# EAGLE design BatDuino1.0 (EAGLE 9.2.0)
CNAME: µgurkrcl; CREVISION: A; DESIGNER: Uğur KIRÇIL

## Sheet 1 of 2: Basic Arduino Func
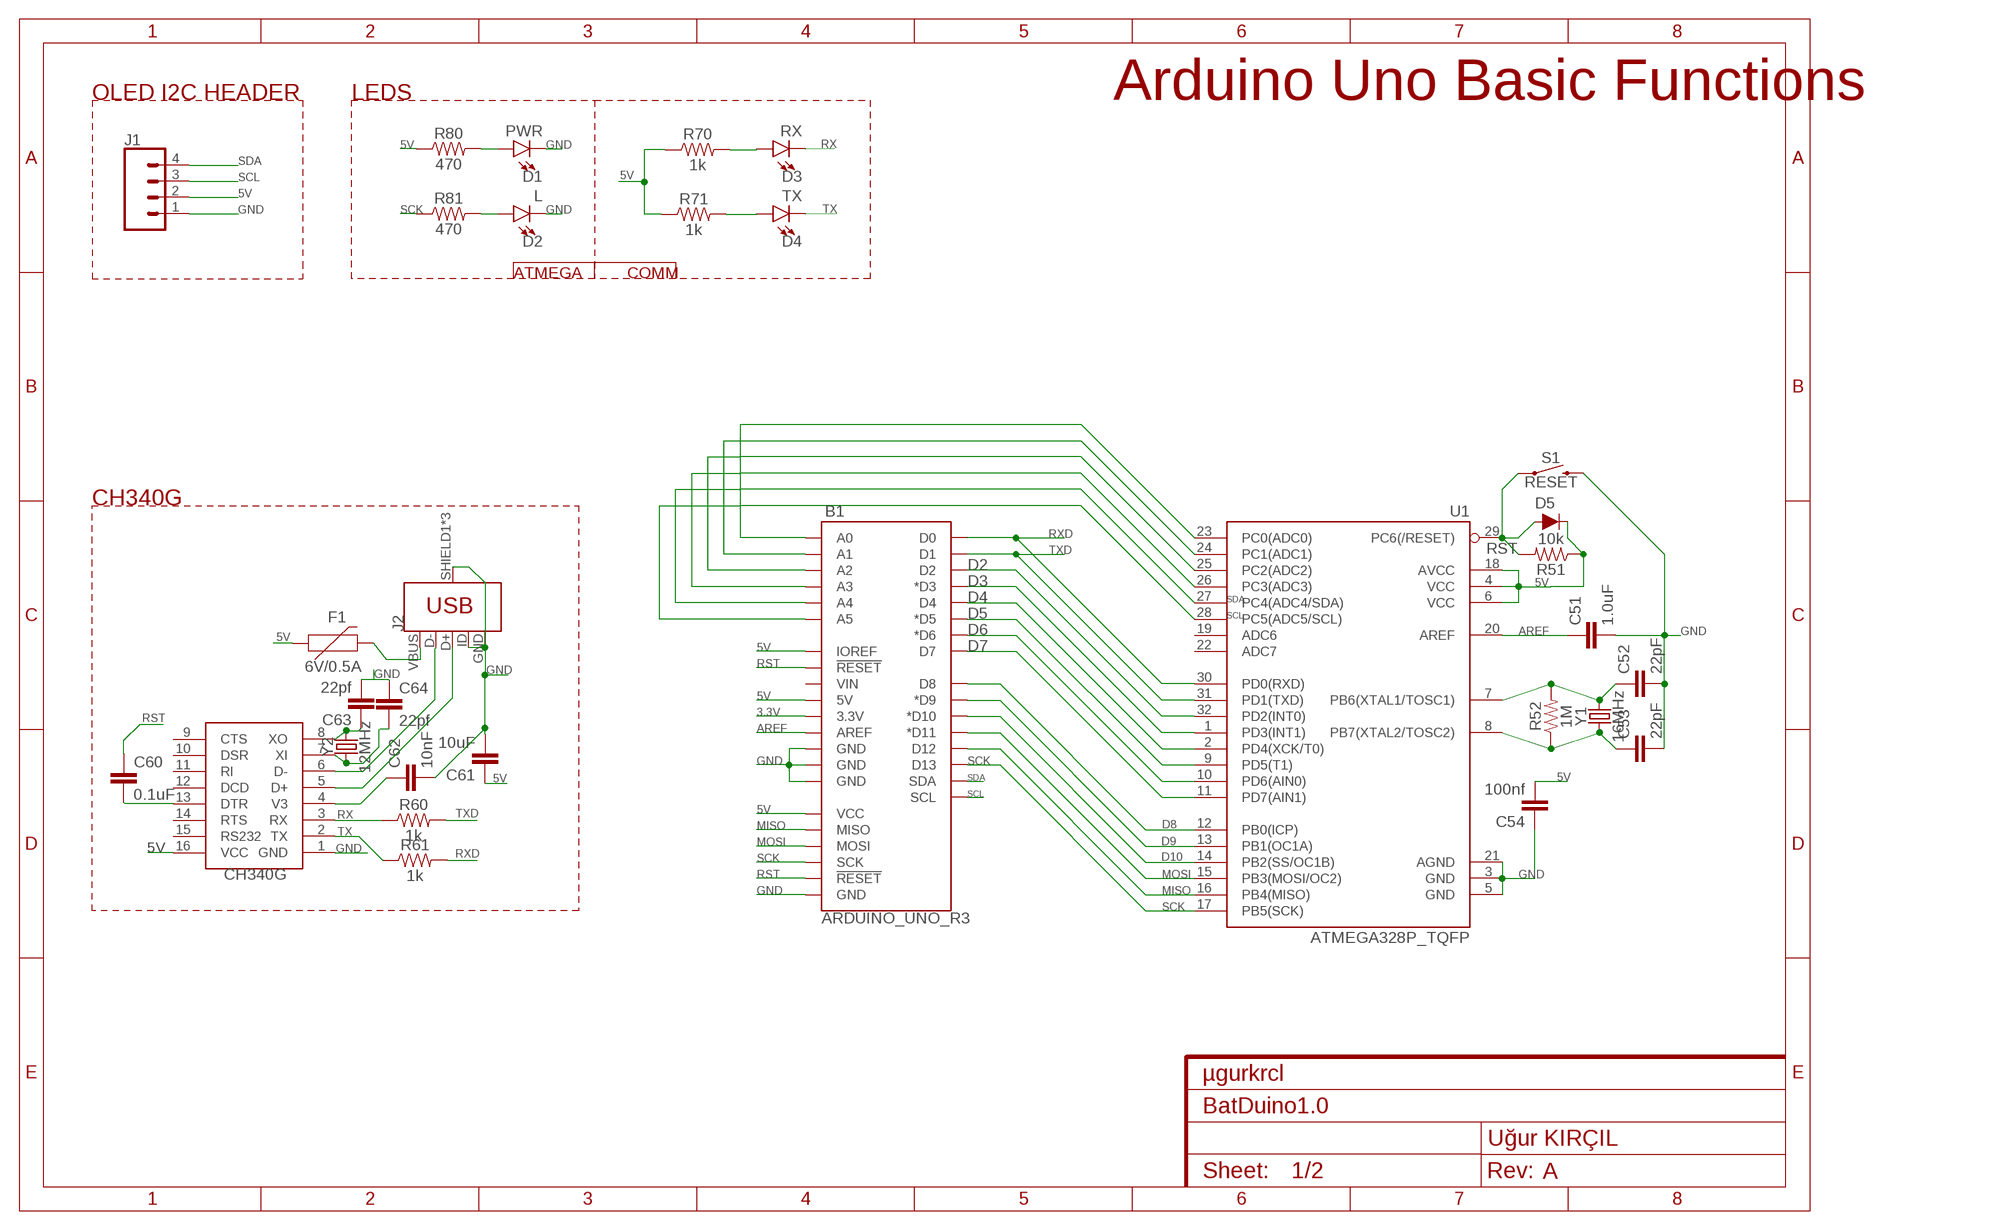
[diagram p0: schematic, sheet 1]

### Parts
B1  ARDUINO_UNO_R3  [ARDUINO_R3]
C51  1.0uF  1.0UF-0603-16V-10%  [0603]
C52  22pF  22PF-0603-50V-5%  [0603]
C53  22pF  22PF-0603-50V-5%  [0603]
C54  100nf  22PF-0603-50V-5%  [0603]
C60  0.1uF  0.1UF-0603-25V-5%  [0603]
C61  10uF  0.18UF-0603-10V-10%  [0603]
C62  10nF  0.18UF-0603-10V-10%  [0603]
C63  22pf  0.18UF-0603-10V-10%  [0603]
C64  22pf  0.18UF-0603-10V-10%  [0603]
D1  PWR  LED-GREEN0603  [LED-0603]
D2  L  LED-GREEN0603  [LED-0603]
D3  RX  LED-GREEN0603  [LED-0603]
D4  TX  LED-GREEN0603  [LED-0603]
D5  DIODE-BAS16J  [SOD-323]
F1  6V/0.5A  PPTC_HALF-AMP  [1206]
J1  CONN_04  [1X04]
J2  USB_MICRO-BREDUCED_PASTE  [USB-B-MICRO-SMD_RED_PASTE]
R51  10k  10KOHM-0603-1/10W-1%  [0603]
R52  1M  1MOHM-0603-1/4W-5%  [0603]
R60  1k  1KOHM-0603-1/10W-1%  [0603]
R61  1k  1KOHM-0603-1/10W-1%  [0603]
R70  1k  1KOHM-0603-1/10W-1%  [0603]
R71  1k  1KOHM-0603-1/10W-1%  [0603]
R80  470  470OHM-0603-1/10W-1%  [0603]
R81  470  470OHM-0603-1/10W-1%  [0603]
S1  RESET  MOMENTARY-SWITCH-SPST-PTH-6.0MM  [TACTILE_SWITCH_PTH_6.0MM]
U1  ATMEGA328P_TQFP  [TQFP32-08]
U$1  CH340G  [SOIC16]
Y1  16MHz  CRYSTAL-16MHZPTH-HC49US  [HC49US]
Y2  12MHz  CRYSTAL-16MHZPTH-HC49US  [HC49US]

### Nets
3.3V: B1.3.3V ; also sheet 2
5V: B1.5V B1.IOREF B1.VCC C54.2 C61.1 D5.C F1.1 J1.2 R51.1 R70.1 R71.1 R80.1 U1.4(VCC) U1.6(VCC) U1.18(AVCC) U$1.16(VCC) ; also sheet 2
AREF: B1.AREF C51.1 U1.20(AREF)
D2: B1.D2 U1.32(PD2(INT0)) ; also sheet 2
D3: B1.D3(*D3) U1.1(PD3(INT1)) ; also sheet 2
D4: B1.D4 U1.2(PD4(XCK/T0)) ; also sheet 2
D5: B1.D5(*D5) U1.9(PD5(T1)) ; also sheet 2
D6: B1.D6(*D6) U1.10(PD6(AIN0)) ; also sheet 2
D7: B1.D7 U1.11(PD7(AIN1))
D8: B1.D8 U1.12(PB0(ICP))
D9: B1.D9(*D9) U1.13(PB1(OC1A))
D10: B1.D10(*D10) U1.14(PB2(SS/OC1B))
GND: B1.GND@1(GND) B1.GND@2(GND) B1.GND@3(GND) B1.GND@4(GND) C51.2 C52.2 C53.2 C54.1 C61.2 C62.2 D1.C D2.C J1.1 J2.GND J2.ID J2.SHIELD1(SHIELD) J2.SHIELD2(SHIELD) J2.SHIELD3(SHIELD) S1.3 U1.3(GND) U1.5(GND) U1.21(AGND) U$1.1(GND) ; also sheet 2
MISO: B1.D12 B1.MISO U1.16(PB4(MISO))
MOSI: B1.D11(*D11) B1.MOSI U1.15(PB3(MOSI/OC2))
N$1: C52.1 R52.2 U1.7(PB6(XTAL1/TOSC1)) Y1.2
N$2: C53.1 R52.1 U1.8(PB7(XTAL2/TOSC2)) Y1.1
N$12: D1.A R80.2
N$13: C62.1 U$1.4(V3)
N$14: F1.2 J2.VBUS
N$15: D3.A R70.2
N$16: D4.A R71.2
N$17: D2.A R81.2
N$18: J2.D+ U$1.5(D+)
N$19: J2.D- U$1.6(D-)
N$20: B1.A0 U1.23(PC0(ADC0))
N$21: B1.A1 U1.24(PC1(ADC1))
N$22: B1.A2 U1.25(PC2(ADC2))
N$23: B1.A3 U1.26(PC3(ADC3))
N$24: C63.1 U$1.8(XO) Y2.2
N$25: C64.2 U$1.7(XI) Y2.1
N$26: C63.2 C64.1
N$27: C60.2 U$1.13(DTR)
RST: B1.RESET@1(!RESET!) B1.RESET@2(!RESET!) C60.1 D5.A R51.2 S1.1 U1.29(PC6(/RESET))
RX: D3.C R60.1 U$1.3(RX)
RXD: B1.D0 R61.2 U1.30(PD0(RXD))
SCK: B1.D13 B1.SCK R81.1 U1.17(PB5(SCK))
SCL: B1.A5 B1.SCL J1.3 U1.28(PC5(ADC5/SCL)) ; also sheet 2
SDA: B1.A4 B1.SDA J1.4 U1.27(PC4(ADC4/SDA)) ; also sheet 2
TX: D4.C R61.1 U$1.2(TX)
TXD: B1.D1 R60.2 U1.31(PD1(TXD))
Unconnected: B1.VIN U1.19(ADC6) U1.22(ADC7) U$1.9(CTS) U$1.10(DSR) U$1.11(RI) U$1.12(DCD) U$1.14(RTS) U$1.15(RS232)

### Notes on the sheet
- OLED I2C HEADER | LEDS | Arduino Uno Basic Functions
- ATMEGA | COMM
- CH340G

## Sheet 2 of 2: FG CHARGER
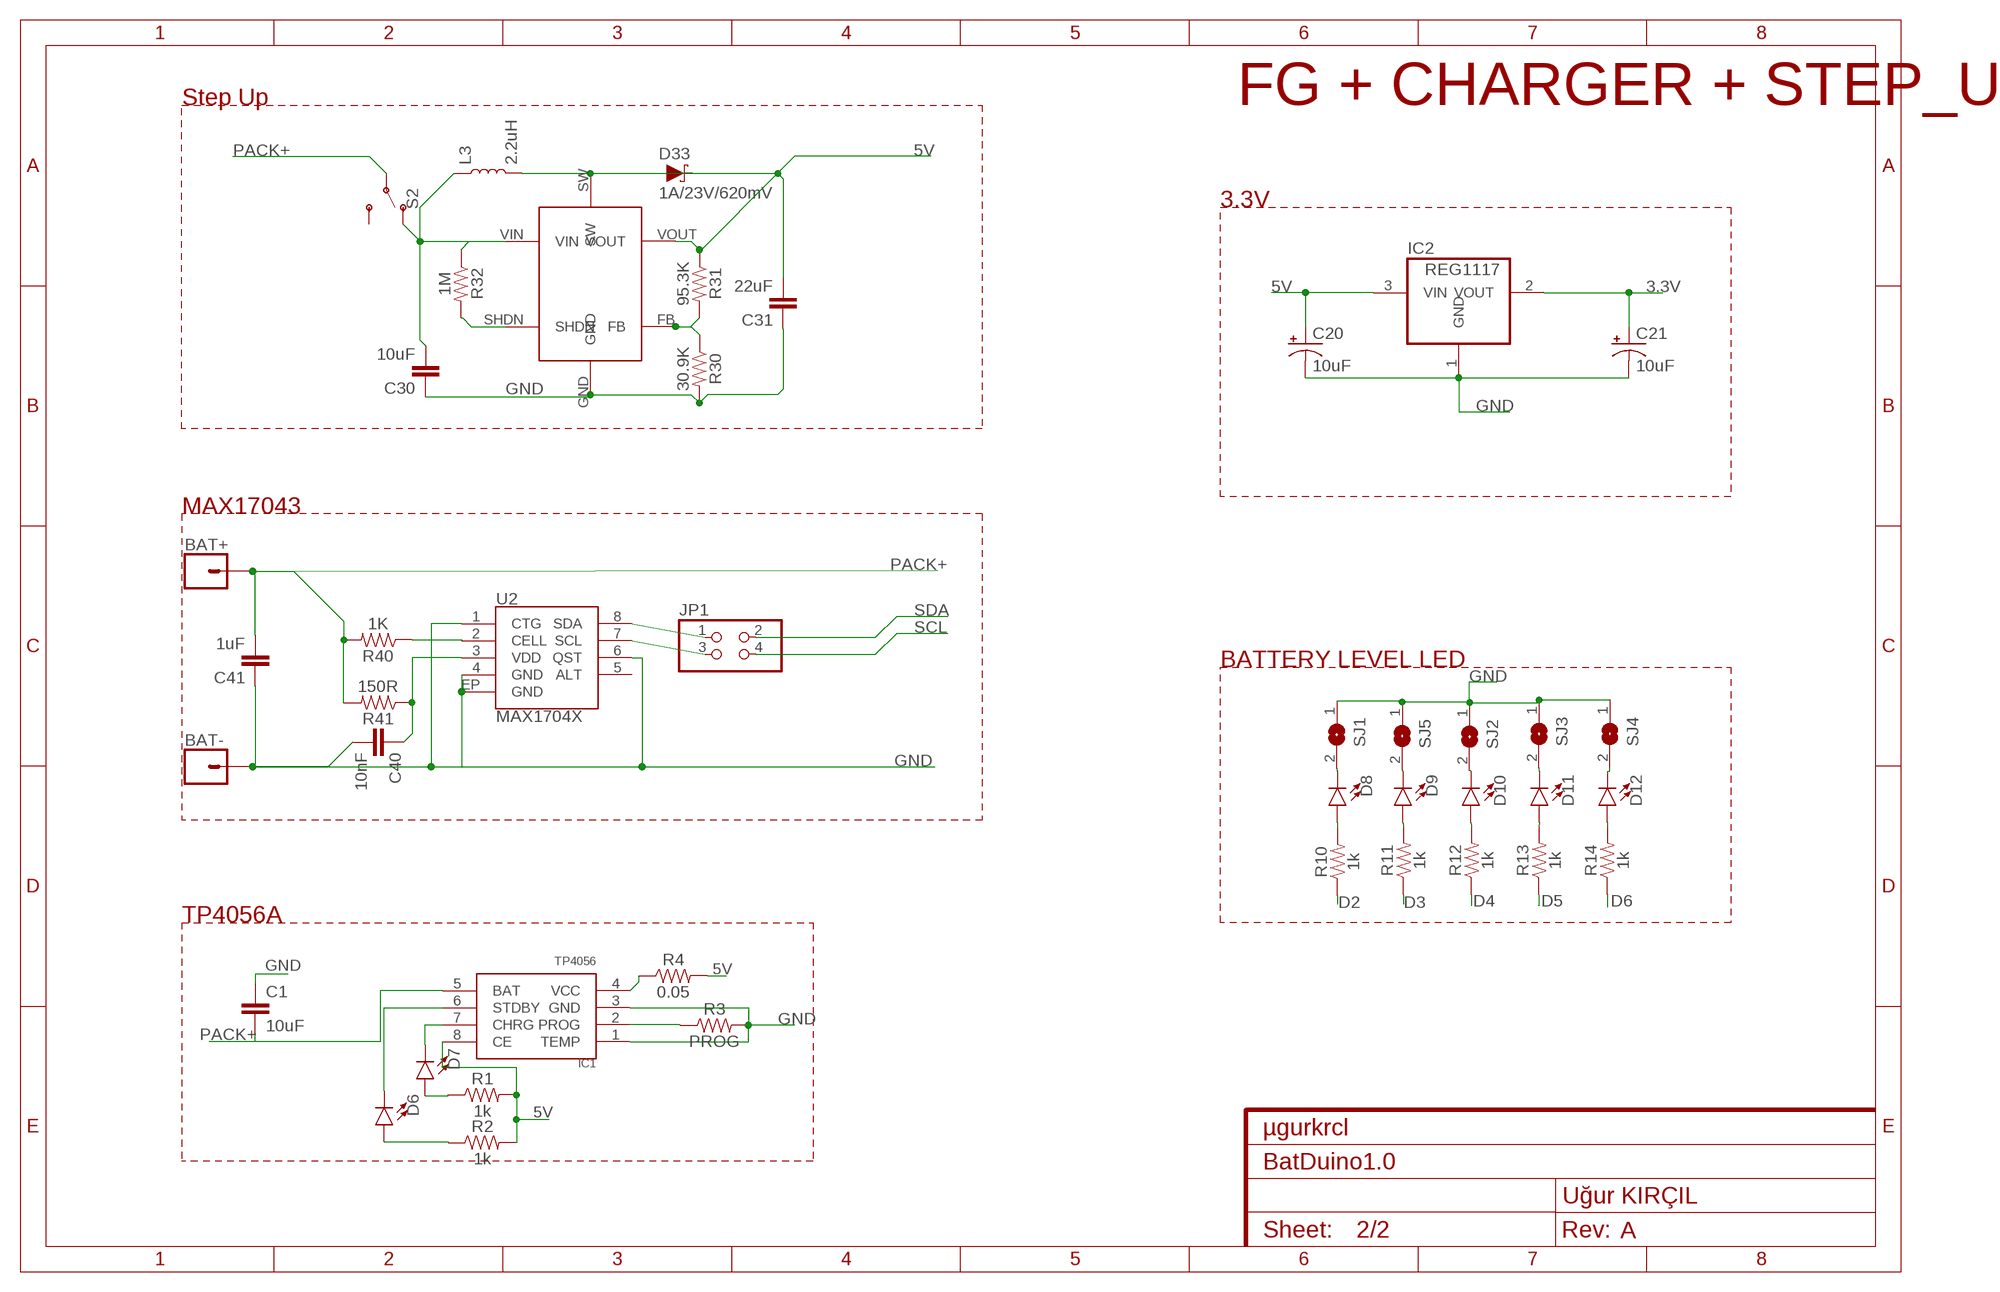
[diagram p1: schematic, sheet 2]

### Parts
BAT+  CONN_01  [1X01]
BAT-  CONN_01  [1X01]
C1  10uF  10UF-0603-6.3V-20%  [0603]
C20  10uF  10UF-POLAR-EIA3528-20V-10%(TANT)  [EIA3528]
C21  10uF  10UF-POLAR-EIA3528-20V-10%(TANT)  [EIA3528]
C30  10uF  0.1UF-0603-25V-(+80/-20%)  [0603]
C31  22uF  0.1UF-0603-25V-(+80/-20%)  [0603]
C40  10nF  0.1UF-0603-25V-(+80/-20%)  [0603]
C41  1uF  0.1UF-0603-25V-(+80/-20%)  [0603]
D6  LED0603  [LED-0603]
D7  LED0603  [LED-0603]
D8  LED0603  [LED-0603]
D9  LED0603  [LED-0603]
D10  LED0603  [LED-0603]
D11  LED0603  [LED-0603]
D12  LED0603  [LED-0603]
D33  1A/23V/620mV  DIODE-SCHOTTKY-BAT20J  [SOD-323]
IC1  TP4056  [SOP-8]
IC2  REG1117  [SOT223]
JP1  PINHD-2X2  [2X02]
L3  2.2uH  INDUCTOR-CDRH-4.7UH  [INDUCTOR_4.7UH]
R1  1k  1KOHM-0603-1/10W-1%  [0603]
R2  1k  1KOHM-0603-1/10W-1%  [0603]
R3  PROG  1KOHM-HORIZ-1/4W-1%  [AXIAL-0.3]
R4  0.05  0.05OHM-0603-1/5W-1%  [0603]
R10  1k  1KOHM-0603-1/10W-1%  [0603]
R11  1k  1KOHM-0603-1/10W-1%  [0603]
R12  1k  1KOHM-0603-1/10W-1%  [0603]
R13  1k  1KOHM-0603-1/10W-1%  [0603]
R14  1k  1KOHM-0603-1/10W-1%  [0603]
R30  30.9K  0.05OHM-0603-1/5W-1%  [0603]
R31  95.3K  0.05OHM-0603-1/5W-1%  [0603]
R32  1M  0.05OHM-0603-1/5W-1%  [0603]
R40  1K  0.05OHM-0603-1/5W-1%  [0603]
R41  150R  0.05OHM-0603-1/5W-1%  [0603]
S2  SWITCH-SPDT-SMD-RIGHT-ANGLE  [SWITCH_SPST_SMD_A]
SJ1  SJ  [SJ]
SJ2  SJ  [SJ]
SJ3  SJ  [SJ]
SJ4  SJ  [SJ]
SJ5  SJ  [SJ]
U2  MAX1704X  [TDFN-8]
U$2  XR1151  [SOT23-6]

### Nets
3.3V: C21.A(+) IC2.2(VOUT) ; also sheet 1
5V: C20.A(+) C31.2 D33.A IC1.8(CE) IC2.3(VIN) R1.2 R2.2 R4.2 R31.1 U$2.VOUT ; also sheet 1
D2: R10.1 ; also sheet 1
D3: R11.1 ; also sheet 1
D4: R12.1 ; also sheet 1
D5: R13.1 ; also sheet 1
D6: R14.1 ; also sheet 1
GND: BAT-.1 C1.1 C20.C(-) C21.C(-) C30.1 C31.1 C40.2 C41.1 IC1.1(TEMP) IC1.3(GND) IC2.1(GND) R3.P$2 R30.2 SJ1.1 SJ2.1 SJ3.1 SJ4.1 SJ5.1 U2.1(CTG) U2.4(GND) U2.6(QST) U2.EP(GND) U$2.GND ; also sheet 1
N$9: R40.1 U2.2(CELL)
N$10: C40.1 R41.1 U2.3(VDD)
N$11: JP1.1 U2.8(SDA)
N$28: D6.C IC1.6(STDBY)
N$29: JP1.3 U2.7(SCL)
N$30: D7.C IC1.7(CHRG)
N$31: D7.A R1.1
N$32: D6.A R2.1
N$33: IC1.4(VCC) R4.1
N$34: IC1.2(PROG) R3.P$1
N$35: C30.2 L3.P$1 R32.1 S2.1(O) U$2.VIN
N$36: D8.C SJ1.2
N$37: D9.C SJ5.2
N$38: D10.C SJ2.2
N$39: D11.C SJ3.2
N$40: D12.C SJ4.2
N$41: D33.C L3.P$2 U$2.SW
N$42: D8.A R10.2
N$43: D9.A R11.2
N$44: D10.A R12.2
N$45: D11.A R13.2
N$46: D12.A R14.2
N$48: R30.1 R31.2 U$2.FB
N$49: R32.2 U$2.SHDN
PACK+: BAT+.1 C1.2 C41.2 IC1.5(BAT) R40.2 R41.2 S2.2(P)
SCL: JP1.4 ; also sheet 1
SDA: JP1.2 ; also sheet 1
Unconnected: S2.3(S) U2.5(ALT)

### Notes on the sheet
- Step Up | FG + CHARGER + STEP_UP
- 3.3V
- MAX17043
- BATTERY LEVEL LED
- TP4056A

## Library data of the parts
B1 = batduino:ARDUINO_UNO_R3: Arduino R3 Footprint with SPI header Arduino Uno R3 Compatible Footprint. Matches PCB size of the original board. SparkFun Products: SAMD21 Dev Breakout <https://www.sparkfun.com/products/13672> RedBoard <https://www.sparkfun.com/products/12757> R3 Stackable Headers <https://www.sparkfun.com/products/11417>
BAT+ BAT- = SparkFun-Connectors:CONN_01: Single connection point. Often used as Generic Header-pin footprint for 0.1 inch spaced/style header connections On any of the 0.1 inch spaced packages, you can populate with these: Break Away Headers - Straight <https://www.sparkfun.com/products/116> (PRT-00116) Break Away Male Headers - Right Angle <https://www.sparkfun.com/products/553> (PRT-00553) Female Headers <https://www.sparkfun.com/products/115> (PRT-00115) Break Away Headers - Machine Pin <https://www.sparkfun.com/products/117> (PRT-00117) Break Away Female Headers - Swiss Machine Pin <https://www.sparkfun.com/products/743> (PRT-00743) This device is also useful as a general connection point to wire up your design to another part of your project. Our various solder wires solder well into these plated through hole pads. Hook-Up Wire - Assortment (Stranded, 22 AWG) <https://www.sparkfun.com/products/11375> (PRT-11375) Hook-Up Wire - Assortment (Solid Core, 22 AWG) <https://www.sparkfun.com/products/11367> (PRT-11367) View the entire wire category on our website here <https://www.sparkfun.com/categories/141> Special notes: SMTSO-256-ET is a "flush mount" nut for a 4-40 screw. We mostly use this on specialty testbeds; it is a nice way to connect hardware to your PCB at an adjustable hieght. Also note, the SNAP packages are for using a snappable style connector. We sell a baggie of snaps and they are also used on two LilyPad designs: Snap Assortment - 30 pack (male and female) <https://www.sparkfun.com/products/11347> (DEV-11347) LilyPad Arduino SimpleSnap <https://www.sparkfun.com/products/10941> (DEV-10941) LilyPad SimpleSnap Protoboard <https://www.sparkfun.com/products/10940> (DEV-10940)
C1 = SparkFun-Capacitors:10UF: 10.0µF ceramic capacitors A capacitor is a passive two-terminal electrical component used to store electrical energy temporarily in an electric field.; PROD_ID: CAP-11015
C20 C21 = SparkFun-Capacitors:10UF-POLAR: 10.0µF polarized capacitors A capacitor is a passive two-terminal electrical component used to store electrical energy temporarily in an electric field.; PROD_ID: CAP-08063
C30 C31 C40 C41 = SparkFun-Capacitors:0.1UF: 0.1µF ceramic capacitors A capacitor is a passive two-terminal electrical component used to store electrical energy temporarily in an electric field.; PROD_ID: CAP-00810; VALUE: 0.1uF
C51 = SparkFun-Capacitors:1.0UF: 1µF ceramic capacitors A capacitor is a passive two-terminal electrical component used to store electrical energy temporarily in an electric field.; PROD_ID: CAP-00868
C52 C53 = SparkFun-Capacitors:22PF: 22pF ceramic capacitors A capacitor is a passive two-terminal electrical component used to store electrical energy temporarily in an electric field.; PROD_ID: CAP-07876
C54 = SparkFun-Capacitors:22PF: 22pF ceramic capacitors A capacitor is a passive two-terminal electrical component used to store electrical energy temporarily in an electric field.; PROD_ID: CAP-07876; VALUE: 22pF
C60 = SparkFun-Capacitors:0.1UF: 0.1µF ceramic capacitors A capacitor is a passive two-terminal electrical component used to store electrical energy temporarily in an electric field.; PROD_ID: CAP-08604
C61-C64 = SparkFun-Capacitors:0.18UF: 0.18µF ceramic capacitor A capacitor is a passive two-terminal electrical component used to store electrical energy temporarily in an electric field.; PROD_ID: CAP-12380; VALUE: 0.18uF
D1-D4 = SparkFun-LED:LED-GREEN: Green SMD LED Used in manufacturing of various products at SparkFun Packages: 0603 - SMD 0603 package [Product Link] <http://www.futureelectronics.com/en/technologies/semiconductors/optoelectronics/leds/Pages/9894312-LTST-C190GKT.aspx?CrossPart=HSMG-C190&IM=0> LilyPad 1206 - SMD1206 LilyPad package [Product Link] <http://www.futureelectronics.com/en/Technologies/Product.aspx?ProductID=IN150NGHARVATEKCORPORATION2049943&IM=0> 1206 - SMD1206 package [Product Link] <http://www.futureelectronics.com/en/technologies/semiconductors/optoelectronics/leds/Pages/8315665-LTST-C150KGKT.aspx?IM=0> 1206 Bottom Mount -SMD 1206 Bottom Mount [Product Link] <http://www.digikey.com/product-detail/en/lite-on-inc/LTST-C230KGKT/160-1456-1-ND/386854> SparkFun Products: Pro Mini 328 -5V <https://www.sparkfun.com/products/821> RedBoard <https://www.sparkfun.com/products/12757> MP3 Trigger <https://www.sparkfun.com/products/13720> Makey Makey <https://www.sparkfun.com/products/11076>; PROD_ID: DIO-00821; VALUE: GREEN
D5 = SparkFun-DiscreteSemi:DIODE: Diode These are standard reverse protection diodes and small signal diodes. SparkFun Products: SparkFun SparkPunk Sound Kit <https://www.sparkfun.com/products/11177> SparkFun ESP8266 Thing <https://www.sparkfun.com/products/13231>; PROD_ID: DIO-09646; VALUE: 250mA/100V
D6-D12 = SparkFun-LED:LED: LED (Generic) Standard schematic elements and footprints for 5mm, 3mm, 1206, and 0603 sized LEDs. Generic LEDs with no color specified.
D33 = SparkFun-DiscreteSemi:DIODE-SCHOTTKY: Schottky diode A Schottky diode is a semiconductor diode which has a low forward voltage drop and a very fast switching action.; PROD_ID: DIO-11623
F1 = SparkFun-Fuses:PPTC: Resettable Fuse PPTC Resettable Fuse. Really a sort of resistor with a polymeric positive temperature coefficient whose resistance increases dramatically with an increase in temperature. When heated by the power passing through the resistance rises causing the current to be limited, protecting the circuit. This is achieved by the transition of the polymer from a crystalline to an amorphous state where the conductive carbon separates breaking the conductive pathways found in the cool crystalline structure. When a PPTC cools back down it resumes conducting letting the circuit turn back on. SparkFun Products: SparkFun RedBoard - Programmed with Arduino <https://www.sparkfun.com/products/12757> Pro Micro - 5V/16MHz <https://www.sparkfun.com/products/12640> Arduino Pro 328 - 5V/16MHz <https://www.sparkfun.com/products/10915> MP3 Trigger <https://www.sparkfun.com/products/13720>; PROD_ID: RES-08585
IC1 = TP4056:TP4056
IC2 = burr-brown:REG1117: 800mA and 1A Low Dropout (LDO) Positive Regulator 1.8V, 2.5V, 2.85V, 3.3V, 5V, and Adj; MPN: REG1117; OC_FARNELL: 1097566; OC_NEWARK: 14P6981
J1 = SparkFun-Connectors:CONN_04: Multi connection point. Often used as Generic Header-pin footprint for 0.1 inch spaced/style header connections On any of the 0.1 inch spaced packages, you can populate with these: Break Away Headers - Straight <https://www.sparkfun.com/products/116> (PRT-00116) Break Away Male Headers - Right Angle <https://www.sparkfun.com/products/553> (PRT-00553) Female Headers <https://www.sparkfun.com/products/115> (PRT-00115) Break Away Headers - Machine Pin <https://www.sparkfun.com/products/117> (PRT-00117) Break Away Female Headers - Swiss Machine Pin <https://www.sparkfun.com/products/743> (PRT-00743) For SCREWTERMINALS and SPRING TERMINALS visit here: Screw Terimnals on SparkFun.com <https://www.sparkfun.com/search/results?term=Screw+Terminals> (5mm/3.5mm/2.54mm spacing) This device is also useful as a general connection point to wire up your design to another part of your project. Our various solder wires solder well into these plated through hole pads. Hook-Up Wire - Assortment (Stranded, 22 AWG) <https://www.sparkfun.com/products/11375> (PRT-11375) Hook-Up Wire - Assortment (Solid Core, 22 AWG) <https://www.sparkfun.com/products/11367> (PRT-11367) View the entire wire category on our website here <https://www.sparkfun.com/categories/141> Special notes: Molex polarized connector foot print use with SKU : PRT-08231 with associated crimp pins and housings. 1MM SMD Version SKU: PRT-10208; PROD_ID: CONN-09696
J2 = SparkFun-Connectors:USB_MICRO-B: USB Type Micro-B Connector Male/female and PTH/SMT variants SparkFun Products: SparkFun microB USB Breakout <https://www.sparkfun.com/products/12035> SparkFun USB microB Plug Breakout <https://www.sparkfun.com/products/10031> SparkFun ESP8266 Thing <https://www.sparkfun.com/products/13231>; PROD_ID: CONN-11752
JP1 = pinhead:PINHD-2X2: PIN HEADER
L3 = SparkFun-Coils:INDUCTOR: Inductors Resist changes in electrical current. Basically a coil of wire. SparkFun Products: SparkFun Load Cell Amplifier - HX711 <https://www.sparkfun.com/products/13879> IOIO-OTG - V2.2 <https://www.sparkfun.com/products/13613>; PROD_ID: NDUC-10146; VALUE: 4.7µH/±30%/1.2A
R1 R2 R10-R14 R60 R61 R70 R71 = SparkFun-Resistors:1KOHM: 1kΩ resistor A resistor is a passive two-terminal electrical component that implements electrical resistance as a circuit element. Resistors act to reduce current flow, and, at the same time, act to lower voltage levels within circuits. - Wikipedia; PROD_ID: RES-07856
R3 = SparkFun-Resistors:1KOHM: 1kΩ resistor A resistor is a passive two-terminal electrical component that implements electrical resistance as a circuit element. Resistors act to reduce current flow, and, at the same time, act to lower voltage levels within circuits. - Wikipedia; PROD_ID: RES-12182; VALUE: 1k
R4 = SparkFun-Resistors:0.05OHM: 0.05Ω resistor A resistor is a passive two-terminal electrical component that implements electrical resistance as a circuit element. Resistors act to reduce current flow, and, at the same time, act to lower voltage levels within circuits. - Wikipedia; PROD_ID: RES-12535
R30-R32 R40 R41 = SparkFun-Resistors:0.05OHM: 0.05Ω resistor A resistor is a passive two-terminal electrical component that implements electrical resistance as a circuit element. Resistors act to reduce current flow, and, at the same time, act to lower voltage levels within circuits. - Wikipedia; PROD_ID: RES-12535; VALUE: 0.05
R51 = SparkFun-Resistors:10KOHM: 10kΩ resistor A resistor is a passive two-terminal electrical component that implements electrical resistance as a circuit element. Resistors act to reduce current flow, and, at the same time, act to lower voltage levels within circuits. - Wikipedia; PROD_ID: RES-00824
R52 = SparkFun-Resistors:1MOHM: 1MΩ resistor A resistor is a passive two-terminal electrical component that implements electrical resistance as a circuit element. Resistors act to reduce current flow, and, at the same time, act to lower voltage levels within circuits. - Wikipedia; PROD_ID: RES-07868
R80 R81 = SparkFun-Resistors:470OHM: 470Ω resistor A resistor is a passive two-terminal electrical component that implements electrical resistance as a circuit element. Resistors act to reduce current flow, and, at the same time, act to lower voltage levels within circuits. - Wikipedia; PROD_ID: RES-07869
S1 = SparkFun-Switches:MOMENTARY-SWITCH-SPST: Momentary Switch (Pushbutton) - SPST Normally-open (NO) SPST momentary switches (buttons, pushbuttons). Variants PTH-12MM - 12mm square, through-hole Momentary Pushbutton Switch - 12mm Square <https://www.sparkfun.com/products/9190> (COM-09190) PTH-6.0MM, PTH-6.0MM-KIT - 6.0mm square, through-hole Mini Pushbutton Switch <https://www.sparkfun.com/products/97> (COM-00097) KIT package intended for soldering kit's - only one side of pads' copper is exposed. PTH-RIGHT-ANGLE-KIT - Right-angle, through-hole Right Angle Tactile Button <https://www.sparkfun.com/products/10791> - Used on SparkFun BigTime Watch Kit <https://www.sparkfun.com/products/11734> SMD-12MM - 12mm square, surface-mount Tactile Button - SMD (12mm) <https://www.sparkfun.com/products/12993> (COM-12993) Used on SparkFun PicoBoard <https://www.sparkfun.com/products/11888> SMD-4.5MM - 4.5mm Square Trackball Switch Used on SparkFun Blackberry Trackballer Breakout <https://www.sparkfun.com/products/13169> SMD-4.6MMX2.8MM - 4.60mm x 2.80mm, surface mount Used on SparkFun SAMD21 Mini Breakout <https://www.sparkfun.com/products/13664> SMD-5.2MM, SMD-5.2-REDUNDANT - 5.2mm square, surface-mount Mini Pushbutton Switch - SMD <https://www.sparkfun.com/products/8720> (COM-08720) Used on Arduino Pro Mini <https://www.sparkfun.com/products/11114> REDUNDANT package connects both switch circuits together SMD-6.0X3.5MM - 6.0 x 3.5mm, surface mount Momentary Reset Switch SMD <https://www.sparkfun.com/products/8229> (COM-08229) SMD-6.2MM-TALL - 6.2mm square, surface mount Tactile Button - SMD (6mm) <https://www.sparkfun.com/products/12992> Used on SparkFun Digital Sandbox <https://www.sparkfun.com/products/12651> SMD-RIGHT-ANGLE - Right-angle, surface mount Used on SparkFun Block for Intel® Edison - Arduino <https://www.sparkfun.com/products/13036>; PROD_ID: SWCH-08441; SF_SKU: COM-00097
S2 = SparkFun-Switches:SWITCH-SPDT: Single Pole, Double Throw (SPDT) Switch Single-pole, double-throw (SPDT) switch. Variant Overview SMD-AYZ0202 Surface Mount DPDT Switch <https://www.sparkfun.com/products/597> (COM-00597) Used on e.g. LilyPad Arduino USB - ATmega32U4 Board <https://www.sparkfun.com/products/12049> PTH-11.6X4.0MM SPDT Mini Power Switch <https://www.sparkfun.com/products/102> (COM-00102) Used on e.g. SparkFun Simon Says - Through-Hole Soldering Kit <https://www.sparkfun.com/products/10547> (KIT-10547) PTH-11.6X4.0MM-KIT KIT version of SPDT Mini Power Switch - Simplifies soldering by removing tStop of switch pins - only one side can be soldered. PTH-11.6X4.0MM-LOCK LOCK version of SPDT Mini Power Switch - Offset pins hold switch in place for easier soldering. SMD-RIGHT-ANGLE Surface Mount Right Angle Switch <https://www.sparkfun.com/products/10860> (COM-10860) Used on e.g. SparkFun ESP8266 Thing <https://www.sparkfun.com/products/13231>; PROD_ID: SWCH-10651; SF_SKU: COM-10860
SJ1-SJ5 = jumper:SJ: SMD solder JUMPER
U1 = SparkFun-IC-Microcontroller:ATMEGA328P_TQFP: Popular 328P in QFP Storefront component: ATmega328 - TQFP <https://www.sparkfun.com/products/13448> (COM-13448) Datasheet <http://www.sparkfun.com/datasheets/Components/SMD/ATMega328.pdf> SparkFun Products SparkFun RedBoard - Programmed with Arduino <https://www.sparkfun.com/products/12757> (DEV-12757) Arduino Pro Mini 328 - 5V/16MHz <https://www.sparkfun.com/products/11113> (DEV-11113) Arduino Pro Mini 328 - 3.3V/8MHz <https://www.sparkfun.com/products/11114> (DEV-11114) SparkFun OpenLog <https://www.sparkfun.com/products/13712> (DEV-13712) SparkFun MicroView - OLED Arduino Module <https://www.sparkfun.com/products/12923> (DEV-12923) SparkFun Digital Sandbox <https://www.sparkfun.com/products/12651> (DEV-12651) SparkFun PicoBoard <https://www.sparkfun.com/products/11888> (WIG-11888) Arduino Fio <https://www.sparkfun.com/products/10116> (DEV-10116) LilyPad Arduino 328 Main Board <https://www.sparkfun.com/products/13342> (DEV-13342) SparkFun RedStick <https://www.sparkfun.com/products/13741> (DEV-13741) LilyPad MP3 <https://www.sparkfun.com/products/11013> (DEV-11013) LilyPad Arduino SimpleSnap <https://www.sparkfun.com/products/10941> (DEV-10941) SparkFun Stepoko <https://www.sparkfun.com/products/13899> (ROB-13899) SparkFun Geiger Counter <https://www.sparkfun.com/products/11345> (SEN-11345) SparkFun EL Sequencer <https://www.sparkfun.com/products/12781> (COM-12781) Arduino Pro 328 - 5V/16MHz <https://www.sparkfun.com/products/10915> (DEV-10915) CryptoCape <https://www.sparkfun.com/products/12773> (DEV-12773) SparkFun IR Thermometer Evaluation Board - MLX90614 <https://www.sparkfun.com/products/10740> (SEN-10740) SparkFun RedBot Mainboard <https://www.sparkfun.com/products/12097> (ROB-12097) Arduino Pro 328 - 3.3V/8MHz <https://www.sparkfun.com/products/10914> (DEV-10914) SparkFun Block for Intel® Edison - Arduino <https://www.sparkfun.com/products/13036> (DEV-13036) SparkFun Simon Says - Surface Mount Soldering Kit <https://www.sparkfun.com/products/10935> (KIT-10935) SparkFun 7-Segment Serial Display - Red <https://www.sparkfun.com/products/11441> (COM-11441) SparkFun 7-Segment Serial Display - White <https://www.sparkfun.com/products/11629> (COM-11629) SparkFun 7-Segment Serial Display - Yellow <https://www.sparkfun.com/products/11443> (COM-11443) SparkFun 7-Segment Serial Display - Kelly Green <https://www.sparkfun.com/products/11440> (COM-11440) SparkFun 7-Segment Serial Display - Blue <https://www.sparkfun.com/products/11442> (COM-11442) SparkFun OpenSegment Serial Display - 20mm (Blue) <https://www.sparkfun.com/products/11647> (COM-11647) SparkFun OpenSegment Serial Display - 20mm (Green) <https://www.sparkfun.com/products/11646> (COM-11646) SparkFun OpenSegment Serial Display - 20mm (White) <https://www.sparkfun.com/products/11648> (COM-11648) SparkFun OpenSegment Serial Display - 20mm (Red) <https://www.sparkfun.com/products/11644> (COM-11644) SparkFun OpenSegment Serial Display - 20mm (Yellow) <https://www.sparkfun.com/products/11645> (COM-11645) SparkFun OpenSegment Shield <https://www.sparkfun.com/products/13190> (DEV-13190); PROD_ID: IC-09069
U2 = sPIC:MAX1704X: MAX17043/MAX17044: Battery Fuel Guage (43 is 1cell, 44 is 2cell); PROD-ID: IC-10399
U$1 = ch340g:CH340G
U$2 = other devices:XR1151
Y1 = SparkFun-Clocks:CRYSTAL-16MHZ: 16MHz Crystal Digikey Example <http://www.digikey.com/product-search/en?keywords=535-9122-1-ND> Frequency: 16MHz Frequency Stability: ±50ppm Frequency Tolerance: ±20ppm Load Capacitance: 18pF SparkFun Products: Pro Micro -5V/16MHz <https://www.sparkfun.com/products/12640> SparkFun Serial Enabled LCD Kit <https://www.sparkfun.com/products/10097>; PROD_ID: XTAL-08181; SF_ID: COM-00536
Y2 = SparkFun-Clocks:CRYSTAL-16MHZ: 16MHz Crystal Digikey Example <http://www.digikey.com/product-search/en?keywords=535-9122-1-ND> Frequency: 16MHz Frequency Stability: ±50ppm Frequency Tolerance: ±20ppm Load Capacitance: 18pF SparkFun Products: Pro Micro -5V/16MHz <https://www.sparkfun.com/products/12640> SparkFun Serial Enabled LCD Kit <https://www.sparkfun.com/products/10097>; PROD_ID: XTAL-08181; SF_ID: COM-00536; VALUE: 16MHz

## Board
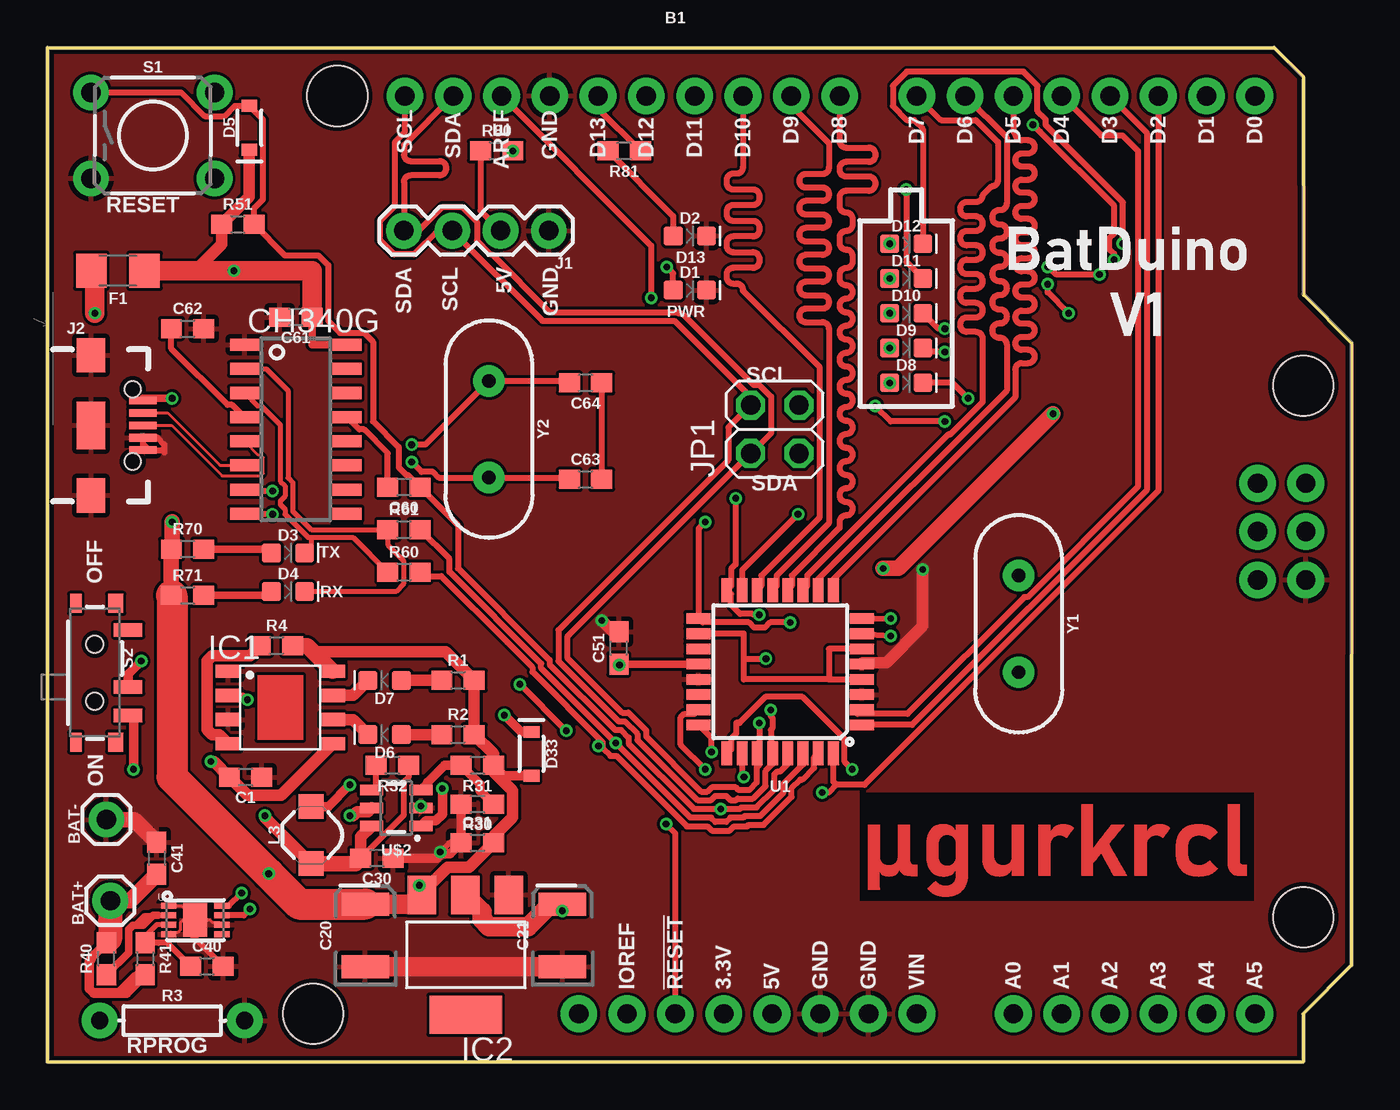
[diagram p2: board, top side]
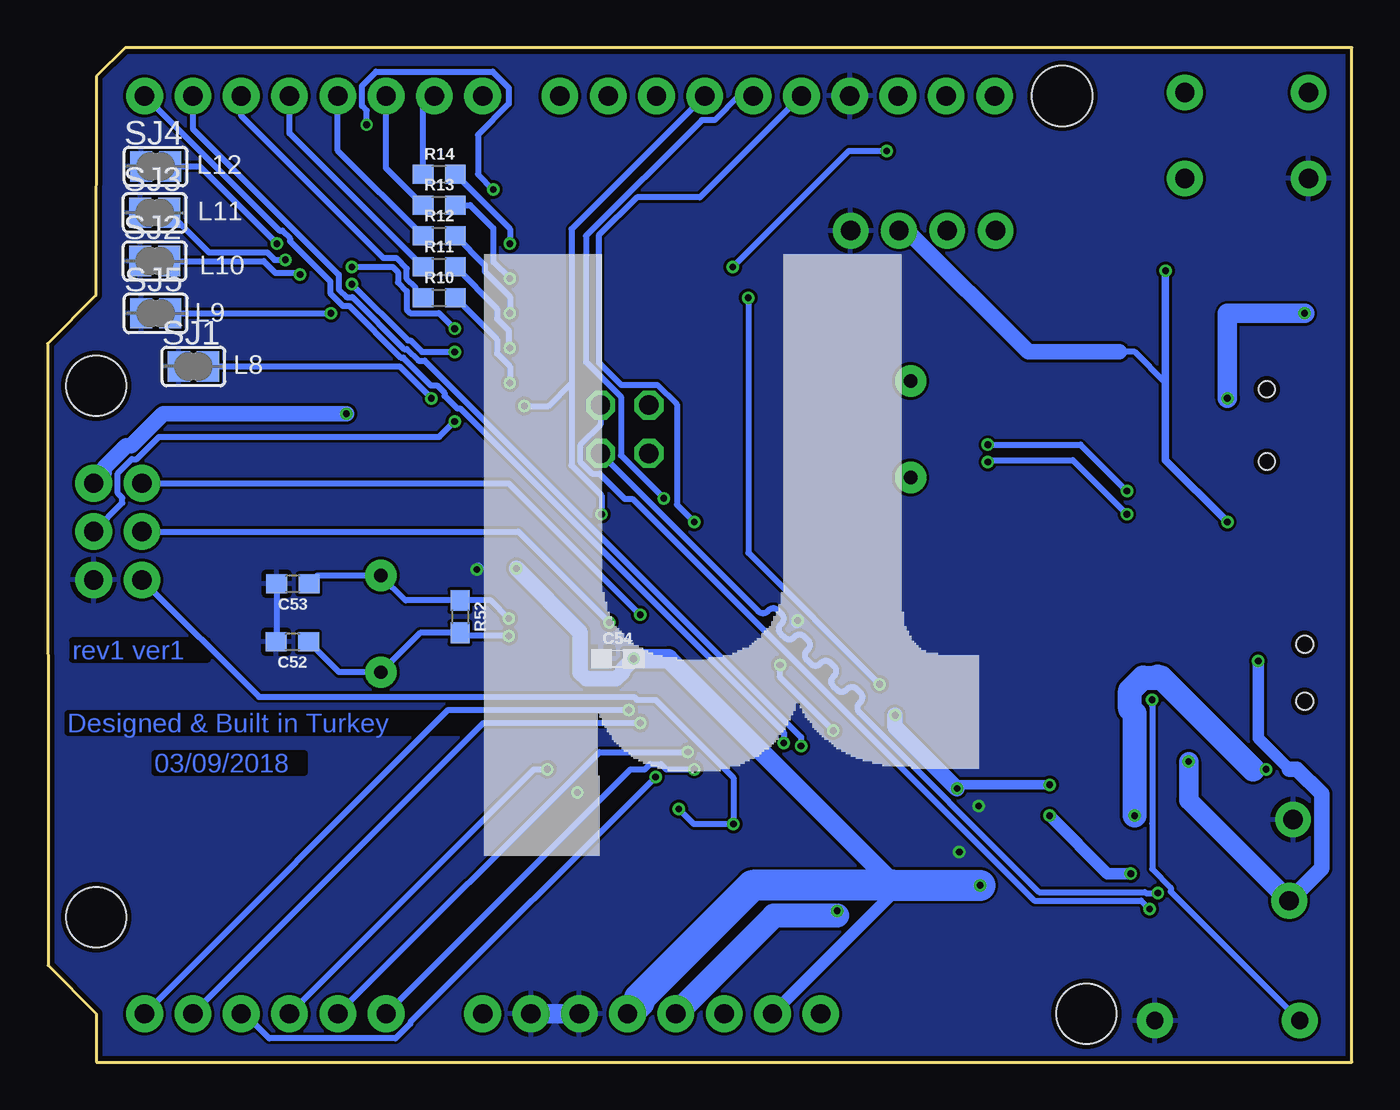
[diagram p3: board, bottom side, seen from below]

Size 68.61 x 53.34 mm. Coordinates in mm from the lower left corner, seen from the top.
Outline: 0,53.34 64.52,53.34 66.04,51.82 66.06,40.31 68.61,37.77 68.58,5.08 66.04,2.54 66.04,0 0,0 0,53.34
Copper layers (1*16): Top 0.035mm / dielectric 1.5mm / Bottom 0.035mm
Design rules "SeeedStudio_2layer_DRU_no_angle_20140221": minimum track width 6mil, minimum drill 12mil, track to track 6mil, track to pad 6mil, pad to pad 6mil, via to via 6mil, smd to smd 0mil, copper to edge 10mil, drill to drill 10mil, minimum pad ring 10mil, minimum via ring 6mil, stop-mask expansion 2mil, vias tented up to drill 100mil, thermal gap 10mil
tRestrict: area 42.7,8.5 to 63.4,14.2

### Footprints (pad centres in the part's own frame; a part is rotated, then mirrored left to right if it is on the bottom)
ARDUINO_R3 = drill 1.016 pad 1.93: 3.3V 2.54,-24.13; 5V 5.08,-24.13; A0 17.78,-24.13; A1 20.32,-24.13; A2 22.86,-24.13; A3 25.4,-24.13; A4 27.94,-24.13; A5 30.48,-24.13; AREF -9.144,24.13; D0 30.48,24.13; D1 27.94,24.13; D2 25.4,24.13; D3 22.86,24.13; D4 20.32,24.13; D5 17.78,24.13; D6 15.24,24.13; D7 12.7,24.13; D8 8.636,24.13; D9 6.096,24.13; D10 3.556,24.13; D11 1.016,24.13; D12 -1.524,24.13; D13 -4.064,24.13; GND@1 7.62,-24.13; GND@2 10.16,-24.13; GND@3 -6.604,24.13; GND@4 33.16,-1.32; IOREF -2.54,-24.13; MISO 30.62,3.76; MOSI 33.16,1.22; NC -5.08,-24.13; RESET@1 0,-24.13; RESET@2 30.62,-1.32; SCK 30.62,1.22; SCL -14.224,24.13; SDA -11.684,24.13; VCC 33.16,3.76; VIN 12.7,-24.13 | hole 3.175: -17.78,24.13; 33.02,8.89; 33.02,-19.05; -19.05,-24.13
1X01 = drill 1.016 pad 1.88: 1 0,0
0603 = smd 1.1 x 1: 1 -0.85,0; 2 0.85,0
EIA3528 = smd 1.2 x 2.5: A 1.65,0; C -1.65,0
LED-0603 = smd 1 x 1: A -0.877,0; C 0.877,0
SOD-323 = smd 0.63 x 0.83: A 1.15,0; C -1.15,0
1206 = smd 1.6 x 1.8: 1 -1.4,0; 2 1.4,0
SOP-8 = smd 1.3 x 0.7: 1 -2.75,1.905; 2 -2.75,0.635; 3 -2.75,-0.635; 4 -2.75,-1.905; 5 2.75,-1.905; 6 2.75,-0.635; 7 2.75,0.635; 8 2.75,1.905
SOT223 = smd 1.499 x 2.007: 1 -2.261,-3.15; 2 0.025,-3.15; 3 2.311,-3.15 | smd 3.81 x 2.007: 4 0,3.15
1X04 = drill 1.016 pad 1.88: 1 0,0; 2 2.54,0; 3 5.08,0; 4 7.62,0
USB-B-MICRO-SMD_RED_PASTE = smd 1.45 x 0.4: D+ 2.725,0; D- 2.725,0.65; GND 2.725,-1.3; ID 2.725,-0.65; VBUS 2.725,1.3 | smd 1.5 x 1.8: SHIELD1 0,3.685; SHIELD2 0,-3.685 | smd 1.5 x 2.5: SHIELD3 0,0 | hole 0.85: 2.2,1.9; 2.2,-1.9
2X02 = drill 1.016 octagon: 1 -1.27,-1.27; 2 -1.27,1.27; 3 1.27,-1.27; 4 1.27,1.27
INDUCTOR_4.7UH = smd 1.3 x 1.3: P$1 -1.5,0; P$2 1.5,0
AXIAL-0.3 = drill 0.9 pad 1.88: P$1 -3.81,0; P$2 3.81,0
TACTILE_SWITCH_PTH_6.0MM = drill 1.016 pad 1.88: 1 -3.251,2.261; 2 3.251,2.261; 3 -3.251,-2.261; 4 3.251,-2.261
SWITCH_SPST_SMD_A = smd 0.7 x 1.5: 1 -2.25,-1.75; 2 -0.75,-1.75; 3 2.25,-1.75 | smd 1 x 0.6: GND1 -3.65,1; GND3 3.65,1 | smd 1 x 0.8: GND2 -3.65,-1.1; GND4 3.65,-1.1 | hole 0.9: -1.5,0; 1.5,0
SJ = smd 1.168 x 1.6: 1 -0.762,0; 2 0.762,0
TQFP32-08 = smd 1.27 x 0.559: 1 -4.293,2.8; 2 -4.293,2; 3 -4.293,1.2; 4 -4.293,0.4; 5 -4.293,-0.4; 6 -4.293,-1.2; 7 -4.293,-2; 8 -4.293,-2.8; 17 4.293,-2.8; 18 4.293,-2; 19 4.293,-1.2; 20 4.293,-0.4; 21 4.293,0.4; 22 4.293,1.2; 23 4.293,2; 24 4.293,2.8 | smd 0.559 x 1.27: 9 -2.8,-4.293; 10 -2,-4.293; 11 -1.2,-4.293; 12 -0.4,-4.293; 13 0.4,-4.293; 14 1.2,-4.293; 15 2,-4.293; 16 2.8,-4.293; 25 2.8,4.293; 26 2,4.293; 27 1.2,4.293; 28 0.4,4.293; 29 -0.4,4.293; 30 -1.2,4.293; 31 -2,4.293; 32 -2.8,4.293
TDFN-8 = smd 0.8 x 0.3: 1 -1.4,0.75; 2 -1.4,0.25; 3 -1.4,-0.25; 4 -1.4,-0.75; 5 1.4,-0.75; 6 1.4,-0.25; 7 1.4,0.25; 8 1.4,0.75 | smd 1.273 x 1.778: EP 0,0
SOIC16 = smd 0.635 x 1.524: 1 -4.445,-2.695; 2 -3.175,-2.695; 3 -1.905,-2.695; 4 -0.635,-2.695; 5 0.635,-2.695; 6 1.905,-2.695; 7 3.175,-2.695; 8 4.445,-2.695; 9 4.445,2.695; 10 3.175,2.695; 11 1.905,2.695; 12 0.635,2.695; 13 -0.635,2.695; 14 -1.905,2.695; 15 -3.175,2.695; 16 -4.445,2.695
SOT23-6 = smd 0.55 x 1.2: FB -0.95,1.3; GND 0,1.3; SHDN -0.95,-1.3; SW 0.95,1.3; VIN 0.95,-1.3; VOUT 0,-1.3
HC49US = drill 0.7 pad 1.651: 1 -2.54,0; 2 2.54,0

### Placement (x,y rotation side)
B1  33.02,26.67 0 top
BAT+  3.3,8.48 90 top
BAT-  3.1,12.75 90 top
C1  10.41,14.99 180 top
C20  16.71,6.65 90 top
C21  27.08,6.65 90 top
C30  17.32,10.72 180 top
C31  22.61,11.53 0 top
C40  8.38,5.03 0 top
C41  5.74,10.72 270 top
C51  30.05,21.77 90 top
C52  55.73,22.1 180 bottom
C53  55.7,25.15 180 bottom
C54  38.63,21.21 0 bottom
C60  18.75,30.23 180 top
C61  13.06,39.17 180 top
C62  7.37,38.56 0 top
C63  28.3,30.63 0 top
C64  28.3,35.71 180 top
D1  33.78,40.59 0 top
D2  33.78,43.43 0 top
D3  12.65,26.77 0 top
D4  12.65,24.74 0 top
D5  10.62,49.12 90 top
D6  17.73,17.22 180 top
D7  17.73,20.07 180 top
D8  45.16,35.71 0 top
D9  45.16,37.54 0 top
D10  45.16,39.37 0 top
D11  45.16,41.2 0 top
D12  45.16,43.03 0 top
D33  25.45,16.21 270 top
F1  3.71,41.61 180 top
IC1  12.24,18.64 0 top
IC2  22,5.64 180 top
J1  26.37,43.71 180 top
J2  2.29,33.48 0 top
JP1  38.25,33.27 90 top
L3  13.87,11.94 90 top
R1  21.59,20.07 0 top
R2  21.59,17.22 0 top
R3  6.55,2.18 0 top
R4  12.04,21.89 0 top
R10  48.01,40.18 0 bottom
R11  48.01,41.81 0 bottom
R12  48.01,43.43 0 bottom
R13  48.01,45.06 0 bottom
R14  48.01,46.69 0 bottom
R30  22.61,13.56 180 top
R31  22.61,15.6 180 top
R32  18.14,15.6 180 top
R40  3.1,5.44 90 top
R41  5.13,5.44 270 top
R51  10.01,44.04 0 top
R52  46.91,23.42 270 bottom
R60  18.75,25.76 0 top
R61  18.75,27.99 0 top
R70  7.37,26.97 0 top
R71  7.37,24.54 0 top
R80  23.62,47.9 0 top
R81  30.33,47.9 180 top
S1  5.54,48.72 0 top
S2  2.49,20.47 90 top
SJ1  60.93,36.58 0 bottom
SJ2  62.97,42.11 0 bottom
SJ3  62.97,44.65 0 bottom
SJ4  62.92,47.09 0 bottom
SJ5  62.92,39.37 0 bottom
U1  38.53,20.52 180 top
U2  7.77,7.47 0 top
U$1  13.06,33.27 270 top
U$2  18.34,13.36 270 top
Y1  51.08,23.04 270 top
Y2  23.22,33.27 270 top

### Tracks (layer width: path | path; a pad name or v marks a point on that pad's centre or on a via)
3.3V  (via drill 0.35)
  Top 0.61: v27.08,7.95 C21.A 26.46,8.3
  Top 1.016: 26.46,8.3 25.28,7.12 23.23,7.12 22.85,7.51 22.85,7.91 IC2.2
  Bottom 0.61: v27.08,7.95 27.08,7.7
  Bottom 1.27: B1.3.3V 30.4,7.7 27.08,7.7
5V  (via drill 0.35)
  Top 0.305: U1.6 41.1,21.72 41.1,20.12 | 41.1,20.12 U1.4 | 41.1,20.12 36.63,20.12 36.63,21.21 | U1.18 36.63,22.52 36.63,21.21 | 36.63,21.21 C54.2 | R80.1 22.77,44.77 J1.2
  Top 0.406: C61.1 13.91,37.72 U$1.16
  Top 0.508: D33.A 24,15.05 R31.1
  Top 0.61: v19.56,9.3 19.68,9.17 | 19.68,9.17 IC2.3 | 13.96,21.58 20.93,21.58 R1.2 R2.2 23.46,16.21 R31.1 23.46,15.26 24.46,14.25 24.46,12.87 23.46,11.87 C31.2 22.17,10.25 21.03,10.25 19.95,9.17 19.68,9.17 | v15.9,12.95 16.06,12.95 16.28,13.17 16.85,13.17 U$2.VOUT | D5.C 10.62,45.5 R51.1 9.16,42.99 7.77,41.6
  Top 0.813: R71.1 R70.1 6.55,27.01 v6.55,28.4 | R4.2 13.65,21.9 13.96,21.58 IC1.8 | v52.88,34.09 44.75,25.96 v43.94,25.96
  Top 1.016: F1.1 7.77,41.6 v9.8,41.6 13.91,41.6 C61.1 | C20.A 19.2,8.3 IC2.3
  Top 1.626: R71.1 arc-90 6.55,24.5 6.55,14.99 v11.63,9.91 13.23,8.3 C20.A
  Bottom 0.305: 9.8,35.71 11.43,37.34 12.24,37.34
  Bottom 0.406: v6.55,28.4 9.8,31.65 9.8,35.71 v9.8,41.6
  Bottom 0.61: B1.IOREF 23.72,9.3 v19.56,9.3 | v15.9,12.95 12.85,9.91 v11.63,9.91
  Bottom 0.813: J1.2 23.4,43.71 17.03,37.34 12.24,37.34 | v52.88,34.09 62.52,34.09 64.2,32.41 64.46,32.41 65.62,31.25 65.62,30.99 B1.VCC | v43.94,25.96 40.59,22.61 40.59,20.48 40.27,20.15 38.7,20.15 38.38,20.48 38.38,20.62 C54.2
  Bottom 1.016: C54.2 35.94,21.21 24.03,9.3
  Bottom 1.626: B1.5V 37.49,3.15 37.49,3.34 31.53,9.3 24.03,9.3 v19.56,9.3
  other vias: 37.78,21.21
AREF  (via drill 0.35)
  Top 0.305: B1.AREF 31.75,42.93 v31.75,40.18 | v24.84,19.86 v27.28,17.42 | v30.08,20.88 C51.1
  Top 0.406: C51.1 U1.20
  Bottom 0.305: v31.75,40.18 31.75,26.77 v24.84,19.86 | v27.28,17.42 30.08,20.23 v30.08,20.88
D2  (via drill 0.35)
  Top 0.305: 41.5,14.58 41.33,14.75 U1.32 | B1.D2 58.42,30.03 42.97,14.58 41.5,14.58 | 41.5,14.58 | 41.5,14.58 | 41.5,14.58 41.09,14.17 v40.75,14.17
  Bottom 0.305: B1.D2 58.42,49.75 50.94,42.27 50.26,42.27 49.71,41.72 49.71,41.18 49.25,40.73 49.25,40.58 R10.1
D3
  Top 0.305: B1.D3 57.81,48.87 57.81,30.06 45.47,17.72 U1.1
  Bottom 0.305: R11.1 55.88,48.83 B1.D3
D4
  Top 0.305: B1.D4 55.42,48.72 56.54,48.72 57.35,47.9 57.35,30.25 51.55,24.45 51.37,24.45 45.23,18.31 42.61,18.31 U1.2
  Bottom 0.305: R12.1 53.34,47.92 B1.D4
D5
  Top 0.305: U1.9 41.33,25.38 50.9,34.95 50.9,36.41 arc-90 51.24,36.75 51.58,36.75 arc90 51.92,37.1 51.92,37.1 arc90 51.58,37.44 51.24,37.44 arc-90 50.9,37.79 50.9,37.79 arc-90 51.24,38.13 51.58,38.13 arc90 51.92,38.47 51.92,38.48 arc90 51.58,38.82 51.24,38.82 arc-90 50.9,39.16 50.9,39.17 arc-90 51.24,39.51 51.58,39.51 arc90 51.92,39.85 51.92,39.85 arc90 51.58,40.2 51.24,40.2 arc-90 50.9,40.54 50.9,40.54 arc-90 51.24,40.89 51.58,40.89 arc90 51.92,41.23 51.92,41.23 arc90 51.58,41.58 51.24,41.58 arc-90 50.9,41.92 50.9,41.92 arc-90 51.24,42.26 51.58,42.26 arc90 51.92,42.61 51.92,42.61 arc90 51.58,42.95 51.24,42.95 arc-90 50.9,43.3 50.9,43.3 arc-90 51.24,43.64 51.58,43.64 arc90 51.92,43.98 51.92,43.99 arc90 51.58,44.33 51.24,44.33 arc-90 50.9,44.67 50.9,44.68 arc-90 51.24,45.02 51.58,45.02 arc90 51.92,45.36 51.92,45.36 arc90 51.58,45.71 51.24,45.71 arc-90 50.9,46.05 50.9,46.05 arc-90 51.24,46.4 51.58,46.4 arc90 51.92,46.74 51.92,46.74 arc90 51.58,47.09 51.24,47.09 arc-90 50.9,47.43 50.9,47.43 arc-90 51.24,47.77 51.58,47.77 arc90 51.92,48.12 51.92,48.12 arc90 51.58,48.46 51.24,48.46 arc-90 50.9,48.8 50.8,48.91 B1.D5
  Bottom 0.305: R13.1 50.8,47 B1.D5
D6
  Top 0.305: B1.D6 50.44,48.62 50.44,45.13 arc-90 50.1,44.79 50.04,44.79 arc90 49.69,44.45 49.69,44.39 arc90 50.04,44.04 50.1,44.04 arc-90 50.44,43.7 50.44,43.64 arc-90 50.1,43.3 50.04,43.3 arc90 49.69,42.96 49.69,42.9 arc90 50.04,42.55 50.1,42.55 arc-90 50.44,42.21 50.44,42.15 arc-90 50.1,41.81 50.04,41.81 arc90 49.69,41.47 49.69,41.41 arc90 50.04,41.07 50.1,41.07 arc-90 50.44,40.72 50.44,40.66 arc-90 50.1,40.32 50.04,40.32 arc90 49.69,39.98 49.69,39.92 arc90 50.04,39.58 50.1,39.58 arc-90 50.44,39.23 50.44,39.17 arc-90 50.1,38.83 50.04,38.83 arc90 49.69,38.49 49.69,38.43 arc90 50.04,38.09 50.1,38.09 arc-90 50.44,37.74 50.44,35.31 40.53,25.39 U1.10
  Bottom 0.305: R14.1 48.86,50.2 B1.D6
D7
  Top 0.305: B1.D7 46.99,49.53 48.82,49.53 49.99,48.36 49.99,46.38 arc-90 49.64,46.04 49.17,45.56 arc-90 48.83,45.22 48.35,45.22 arc90 48.01,44.88 48.01,44.81 arc90 48.35,44.46 48.83,44.46 arc-90 49.17,44.12 49.17,44.05 arc-90 48.83,43.7 48.35,43.7 arc90 48.01,43.36 48.01,43.29 arc90 48.35,42.95 48.83,42.95 arc-90 49.17,42.6 49.17,42.53 arc-90 48.83,42.19 48.35,42.19 arc90 48.01,41.84 48.01,41.77 arc90 48.35,41.43 48.83,41.43 arc-90 49.17,41.09 49.17,41.01 arc-90 48.83,40.67 48.35,40.67 arc90 48.01,40.33 48.01,40.25 arc90 48.35,39.91 48.83,39.91 arc-90 49.17,39.57 49.17,39.49 arc-90 48.83,39.15 48.35,39.15 arc90 48.01,38.81 48.01,38.73 arc90 48.35,38.39 48.83,38.39 arc-90 49.17,38.05 49.17,34.7 47.48,33 47.37,33 39.95,25.58 39.95,25.03 U1.11
D8
  Top 0.305: U1.12 39.15,25.03 39.15,25.58 41.66,28.09 41.66,28.4 arc-90 42,28.74 arc90 42.34,29.08 42.34,29.11 arc90 42,29.45 arc-90 41.66,29.8 41.66,29.82 arc-90 42,30.16 arc90 42.34,30.51 42.34,30.53 arc90 42,30.88 arc-90 41.66,31.22 41.66,31.25 arc-90 42,31.59 arc90 42.34,31.93 42.34,31.96 arc90 42,32.3 arc-90 41.66,32.64 41.66,32.67 arc-90 42,33.01 arc90 42.34,33.36 42.34,33.38 arc90 42,33.73 arc-90 41.66,34.07 41.66,34.09 arc-90 42,34.44 arc90 42.34,34.78 42.34,34.81 arc90 42,35.15 arc-90 41.66,35.49 41.66,35.52 arc-90 42,35.86 arc90 42.34,36.2 42.34,36.23 arc90 42,36.57 arc-90 41.66,36.92 41.66,36.94 arc-90 42,37.29 arc90 42.34,37.63 42.34,37.66 arc90 42,38 arc-90 41.66,38.34 41.66,38.37 arc-90 42,38.71 arc90 42.34,39.05 42.34,39.08 arc90 42,39.42 arc-90 41.66,39.77 41.66,39.79 arc-90 42,40.13 arc90 42.34,40.48 42.34,40.5 arc90 42,40.85 arc-90 41.66,41.19 41.66,41.4 arc-90 42,41.74 arc90 42.34,42.09 42.34,42.38 arc90 42,42.72 arc-90 41.66,43.06 41.66,43.35 arc-90 42,43.7 arc90 42.34,44.04 42.34,44.33 arc90 42,44.67 arc-90 41.66,45.01 41.66,45.47 arc-90 42,45.81 43.19,45.81 arc90 43.54,46.15 43.54,46.22 arc90 43.19,46.57 42,46.57 arc-90 41.66,46.91 41.66,46.98 arc-90 42,47.33 43.19,47.33 arc90 43.54,47.67 43.54,47.74 arc90 43.19,48.08 42,48.08 arc-90 41.66,48.43 B1.D8
D9
  Top 0.305: B1.D9 39.12,50.29 41.1,48.31 41.1,47.03 arc-90 40.75,46.69 39.88,46.69 arc90 39.54,46.35 39.54,46.33 arc90 39.88,45.98 40.75,45.98 arc-90 41.1,45.64 41.1,45.62 arc-90 40.75,45.27 39.88,45.27 arc90 39.54,44.93 39.54,44.91 arc90 39.88,44.57 40.75,44.57 arc-90 41.1,44.22 41.1,44.2 arc-90 40.75,43.86 39.88,43.86 arc90 39.54,43.52 39.54,43.49 arc90 39.88,43.15 40.75,43.15 arc-90 41.1,42.81 41.1,42.78 arc-90 40.75,42.44 39.88,42.44 arc90 39.54,42.1 39.54,42.08 arc90 39.88,41.73 40.75,41.73 arc-90 41.1,41.39 41.1,41.37 arc-90 40.75,41.02 39.88,41.02 arc90 39.54,40.68 39.54,40.66 arc90 39.88,40.32 40.75,40.32 arc-90 41.1,39.97 41.1,39.95 arc-90 40.75,39.61 39.88,39.61 arc90 39.54,39.27 39.54,39.24 arc90 39.88,38.9 40.75,38.9 arc-90 41.1,38.56 41.1,28.33 38.35,25.58 38.35,25.03 U1.13
D10
  Top 0.305: U1.14 37.55,25.03 37.55,25.58 40.62,28.65 40.62,36.52 36.58,40.57 36.58,40.59 arc90 36.23,40.93 36.05,40.93 arc-90 35.71,41.27 35.71,41.41 arc-90 36.05,41.76 37.1,41.76 arc90 37.44,42.1 37.44,42.24 arc90 37.1,42.58 36.05,42.58 arc-90 35.71,42.92 35.71,43.06 arc-90 36.05,43.41 37.1,43.41 arc90 37.44,43.75 37.44,43.89 arc90 37.1,44.23 36.05,44.23 arc-90 35.71,44.58 35.71,44.71 arc-90 36.05,45.06 37.1,45.06 arc90 37.44,45.4 37.44,45.54 arc90 37.1,45.88 36.05,45.88 arc-90 35.71,46.23 35.71,46.36 arc-90 36.05,46.71 36.23,46.71 arc90 36.58,47.05 B1.D10
GND  (via drill 0.35)
  Top 0.152: U2.1 7.02,8.22 7.47,7.77 U2.EP | U2.EP 8.55,7.47 8.68,7.34 9.05,7.34 U2.6 | U2.EP 7.12,7.47 7,7.35 7,6.97 6.87,6.84 6.49,6.84 U2.4
  Top 0.305: C40.2 7.47,6.79 7.47,7.77 | C31.1 21.13,11.53 v20.65,11.05 | U$2.GND v19.64,13.46 | J2.ID J2.GND 5.33,32.18 | 5.33,32.18 6.02,32.18 6.15,32.05 6.15,32.46 5.78,32.83 J2.ID | J2.ID 5.01,32.5 5.33,32.18
  Top 0.508: R30.2 C31.1 21.18,10.96 20.74,10.96 20.5,10.72 C30.1
  Top 0.61: C51.2 29.75,22.62 v29.16,23.21 | U1.5 42.89,20.99 44.11,20.99 46.03,22.91 v46.03,25.91 | C21.C 26.47,5
  Top 0.813: C41.1 4.56,12.75 BAT-.1
  Top 1.016: 26.47,5 24.84,5 22.4,5 | 22.4,5 C20.C | 22.4,5
  Bottom 0.305: C53.2 56.55,22.12 C52.2 | v20.65,11.05 20.52,10.92 | v19.64,13.46 19.56,13.38
  Bottom 0.61: v29.16,23.21 29.23,23.14 | v46.03,25.91 45.97,25.96
  Bottom 1.016: B1.GND@1 B1.GND@2
  pour Top: 0.25,53.19 64.47,53.19 65.89,51.77 65.89,40.39 68.53,37.74 68.53,5.23 65.89,2.59 65.89,0.15 0.25,0.15
  pour Bottom: 0.46,52.98 64.47,52.98 65.68,51.77 65.68,40.39 68.33,37.74 68.33,5.23 65.68,2.59 65.68,0.15 0.25,0.15 0.25,52.98
MISO  (via drill 0.35)
  Top 0.305: v36.19,29.64 36.19,26.17 35.95,25.93 35.95,25.03 U1.16 35.95,24.6 35.95,24.05 36.43,23.57 37.07,23.57 37.12,23.52 v37.44,23.52
  Bottom 0.305: B1.D12 32.24,50.8 33.51,49.53 34.19,49.53 40.28,43.43 40.28,36.81 38.46,34.99 38.46,31.9 v36.19,29.64 | B1.MISO 44.35,30.43 v37.44,23.52
MOSI  (via drill 0.35)
  Top 0.305: v39.47,28.8 36.53,25.86 U1.15 | v47.19,33.68 44.35,33.68 v43.54,34.49
  Bottom 0.305: v39.47,28.8 39.47,29.8 41.05,31.37 41.05,35.71 | 41.05,35.71 41.05,43.79 B1.D11 | B1.MOSI 64.67,29.4 64.67,29.66 64.91,29.9 64.91,30.96 64.17,31.7 63.9,31.7 62.74,32.87 48.01,32.87 v47.19,33.68 | v43.54,34.49 42.27,34.49 41.05,35.71
N$1  (via drill 0.35)
  Top 0.305: U1.7 v44.35,22.41
  Bottom 0.305: v44.35,22.41 46.91,22.41 R52.2 49.01,22.57 Y1.2 53.28,20.5 C52.1
N$2  (via drill 0.35)
  Top 0.305: U1.8 v44.35,23.32
  Bottom 0.305: v44.35,23.32 45.3,24.27 R52.1 49.77,24.27 Y1.1 54.42,25.58 C53.1
N$9
  Top 0.254: 4.35,6.95 5.12,7.72 5.33,7.72 5.82,7.72 U2.2
  Top 0.406: R40.1 4.27,5.76 4.27,6.98 4.48,7.19 5.04,7.19 5.56,7.72 5.82,7.72
N$10
  Top 0.152: 6.33,7.26 U2.3
  Top 0.254: 6.33,7.26 6.05,7.26 6.02,7.23 5.76,7.23 5.13,6.6 5.13,6.45
  Top 0.305: C40.1 6.3,6.26 5.85,6.26 5.82,6.29 R41.1
  Top 0.406: R41.1 5.13,6.45
N$11  (via drill 0.35)
  Top 0.305: U2.8 9.54,8.22 v10.21,8.89
  Bottom 0.305: JP1.1 31.22,23.7 arc-90 30.74,23.7 30.68,23.76 arc90 30.19,23.76 29.99,23.56 arc90 29.99,23.07 30.05,23.01 arc-90 30.05,22.53 29.84,22.32 arc-90 29.36,22.32 29.3,22.38 arc90 28.81,22.38 28.61,22.18 arc90 28.61,21.69 28.67,21.63 arc-90 28.67,21.15 28.46,20.94 arc-90 27.98,20.94 27.92,21 arc90 27.43,21 27.23,20.8 arc90 27.23,20.31 27.29,20.25 arc-90 27.29,19.77 27.08,19.56 arc-90 26.6,19.56 26.54,19.62 arc90 26.05,19.62 25.85,19.42 arc90 25.85,18.93 25.91,18.88 arc-90 25.91,18.39 16.46,8.94 10.9,8.94 10.85,8.89 v10.21,8.89
N$12  (via drill 0.35)
  Top 0.305: D1.A 32.91,41.47 v32.56,41.81
  Bottom 0.305: v32.56,41.81 26.47,47.9 R80.2
  other vias: 24.47,47.9
N$13
  Top 0.305: U$1.4 9.71,34.56 9.47,34.56 6.52,37.51 C62.1
N$14  (via drill 0.35)
  Top 0.305: J2.VBUS arc-90 5.13,34.9 v6.55,34.9
  Top 0.406: J2.VBUS 5.01,34.9 v6.55,34.9
  Top 1.016: v2.49,39.37 2.49,41.6 F1.2
  Bottom 1.016: v6.55,34.9 6.55,39.37 v2.49,39.37
N$15
  Top 0.406: R70.2 11.57,26.98 D3.A
N$16
  Top 0.406: R71.2 11.57,24.54 D4.A
N$17
  Top 0.305: R81.2 32.91,44.48 D2.A
N$18
  Top 0.152: J2.D+ 6.53,33.48 9.18,30.82 11.22,30.82 11.35,30.96 11.35,31.78 11.22,31.91 11.08,31.91 U$1.5
N$19
  Top 0.152: J2.D- 6.31,34.13 9.07,31.37 U$1.6
N$20  (via drill 0.35)
  Top 0.305: U1.23 34.02,18.31 33.48,18.31 33.3,18.13 33.3,16.69 v34.59,15.39
  Bottom 0.305: B1.A0 37.95,15.39 37.19,15.39 36.91,15.67 36.34,15.67 36.07,15.39 v34.59,15.39
N$21  (via drill 0.35)
  Top 0.305: v34.92,16.3 34.92,17.04 U1.24
  Bottom 0.305: B1.A1 39.58,16.3 v34.92,16.3
N$22  (via drill 0.35)
  Top 0.305: v42.32,15.39 41.92,15.79 41.92,16.99 39.71,19.2 37.76,19.2 36.39,17.83 36.22,17.83 36.22,17.27 35.95,16.99 35.95,16.45 U1.25
  Bottom 0.305: B1.A2 43.03,15.39 v42.32,15.39
N$23  (via drill 0.35)
  Top 0.305: U1.26 36.53,15.08 v36.63,14.99
  Bottom 0.305: v36.63,14.99 49.53,2.08 49.53,2.01 50.3,1.25 56.95,1.25 58.24,2.54 B1.A3
N$24  (via drill 0.35)
  Top 0.305: v19.15,31.55 19.67,31.03 20.27,31.03 20.57,30.73 Y2.2 27.34,30.73 C63.1 | v11.84,28.8 10.39,28.8 U$1.8
  Bottom 0.305: v19.15,31.55 19.15,31.65 14.68,31.65 v11.84,28.8
N$25  (via drill 0.35)
  Top 0.305: v19.15,32.46 19.86,32.46 Y2.1 27.34,35.81 C64.2 | v11.84,30.02 10.44,30.02 U$1.7
  Bottom 0.305: v19.15,32.46 14.28,32.46 v11.84,30.02
N$26
  Top 0.305: C64.1 C63.2
N$27
  Top 0.305: U$1.13 16.4,33.26 16.64,33.26 17.89,32.01 C60.2
N$28
  Top 0.61: IC1.6 16.07,18.01 D6.C
N$29  (via drill 0.35)
  Top 0.305: v10.65,8.04 10.32,7.72 U2.7
  Bottom 0.305: JP1.3 39.52,33.51 40.59,32.45 40.59,31.56 39.96,30.94 39.57,30.94 38.25,29.62 37.85,29.62 21.59,13.36 16.71,8.48 11.09,8.48 v10.65,8.04
N$30
  Top 0.61: IC1.7 16.07,19.28 D7.C
N$31
  Top 0.61: D7.A R1.1
N$32
  Top 0.61: D6.A R2.1
N$33
  Top 0.61: R4.1 10.65,21.36 8.65,21.36 8.39,21.09 8.39,17.47 8.65,17.2 9.03,17.2 IC1.4
N$34  (via drill 0.35)
  Top 0.305: IC1.2 10.28,19.28 v10.51,19.05
  Bottom 0.305: R3.P$1 9.53,8.97 9.53,9.17 10.51,10.16 10.51,12.54 10.49,12.57 10.49,18.71 10.51,18.73 v10.51,19.05
N$35  (via drill 0.35)
  Top 0.305: C30.2 18.73,12.98 18.73,14.71 18.99,14.96 R32.1
  Top 0.508: v4.52,15.39 4.52,17.94 S2.1
  Top 0.61: U$2.VIN 16.47,11.84 C30.2 | L3.P$1 11.43,12.88 v11.43,12.95
  Top 0.813: C30.2 16.19,10.44 L3.P$1
  Bottom 0.61: 5.21,15.39 4.57,15.39 4.55,15.42 v4.52,15.39
  Bottom 1.27: v11.43,12.95 11.43,18.32 11.68,18.57 11.68,19.53 11,20.22 10.26,20.22 10.21,20.27 10.16,20.22 10.03,20.22 5.21,15.39
N$36  (via drill 0.35)
  Top 0.305: v48.41,34.9 47.6,35.71 D8.C
  Bottom 0.305: SJ1.2 50.09,36.58 v48.41,34.9
N$37  (via drill 0.35)
  Top 0.305: v53.7,39.37 52.6,40.46 v52.6,40.9 | v47.19,37.34 46.24,37.34 D9.C
  Bottom 0.305: SJ5.2 v53.7,39.37 | v52.6,40.9 49.65,37.95 49.52,37.95 48.91,37.34 v47.19,37.34
N$38  (via drill 0.35)
  Top 0.305: v47.19,38.56 46.85,38.56 D10.C | v55.32,41.4 53.06,41.4 52.89,41.58 52.83,41.58 v52.6,41.81
  Bottom 0.305: v55.32,41.4 55.42,41.5 56.62,41.5 57.24,42.11 SJ2.2 | v52.6,41.81 50.44,41.81 50.17,41.53 50.17,40.99 49.71,40.54 49.71,39.56 49.53,39.38 48.01,39.38 v47.19,38.56
N$39  (via drill 0.35)
  Top 0.305: v56.1,42.18 56.1,42.5 55.86,42.74 55.86,43.31 56.1,43.55 56.1,45.02 52.2,48.92 52.19,48.92 v51.82,49.28 | v45.16,45.87 45.16,42.08 D11.C
  Bottom 0.305: v51.82,49.28 51.82,50.03 52.07,50.27 52.07,51.33 51.33,52.07 45.19,52.07 44.35,51.22 44.35,50.38 45.97,48.75 45.97,46.69 v45.16,45.87 | SJ3.2 60.12,42.57 57.05,42.57 56.66,42.18 v56.1,42.18
N$40  (via drill 0.35)
  Top 0.305: D12.C 46.04,49.06 45.57,49.53 45.19,49.53 44.45,50.27 44.45,51.33 45.19,52.07 51.33,52.07 52.07,51.33 52.07,50 52.51,49.56 52.51,49.26 56.56,45.2 56.56,43.37 56.54,43.35 v56.54,43.03
  Bottom 0.305: SJ4.2 60.6,47.09 v56.54,43.03
N$41  (via drill 0.35)
  Top 0.508: L3.P$2 14.76,13.44 v15.9,14.58 | U$2.SW 19.91,12.68 20.41,12.68 20.77,13.04 v20.77,14.38 | v24.03,18.24 24.91,17.36 D33.C
  Bottom 0.508: v15.9,14.58 20.57,14.58 v20.77,14.38
  Bottom 0.813: v20.77,14.38 24.03,17.64 v24.03,18.24
N$42  (via drill 0.35)
  Bottom 0.305: R10.2 44.97,37.99 44.97,37.26 44.28,36.58 D8.A
  other vias: 44.28,35.71
N$43  (via drill 0.35)
  Bottom 0.305: R11.2 44.97,39.62 44.97,39.09 44.35,38.47 44.35,37.6 D9.A
  other vias: 44.28,37.54
N$44  (via drill 0.35)
  Bottom 0.305: R12.2 45.62,41.9 45.62,41.57 44.28,40.23 D10.A
  other vias: 44.28,39.37
N$45  (via drill 0.35)
  Bottom 0.305: R13.2 46.38,45.06 45.16,43.84 45.16,42.08 D11.A
  other vias: 44.28,41.2
N$46  (via drill 0.35)
  Bottom 0.305: R14.2 44.28,43.81 D12.A
  other vias: 44.28,43.03
N$48
  Top 0.508: U$2.FB 19.98,14.66 19.98,14.7 20.88,15.6 R31.2 22.75,14.61 22.75,14.27 R30.1
N$49
  Top 0.305: U$2.SHDN 17.29,14.56 R32.2
PACK+  (via drill 0.35)
  Top 0.305: 2.47,3.73 3.72,3.73 4.58,4.59 R41.2 | 2.47,5.66 3.29,6.47
  Top 0.508: R41.2 4.17,3.63 2.43,3.63 2.19,3.87 2.19,5.3 2.29,5.41 2.29,5.48 2.47,5.66 R40.2 3.29,6.47 | S2.2 4.24,20.39 v4.93,21.08
  Top 0.61: IC1.5 12.28,14.03 10.52,14.03 C1.2 8.75,15.8 v8.59,15.8
  Top 0.813: C41.2 4.36,8.48 BAT+.1
  Top 1.27: BAT+.1 3.3,7.41 3.29,7.39 3.29,6.47
  Bottom 0.61: 3.3,15.39 3.91,16 4.93,17.02 v4.93,21.08
  Bottom 0.813: 3.3,15.39 2.9,15.39 1.6,14.1 1.6,10.18 BAT+.1
  Bottom 1.016: v8.59,15.8 8.59,13.77 BAT+.1
RST  (via drill 0.35)
  Top 0.305: U1.29 38.93,15.68 38.54,15.29 38.39,15.29 38.22,15.12 38.22,14.32 37.29,13.39 36.49,13.39 36.41,13.31 v35.41,13.31 34,13.31 30.57,16.74 30.57,17.06 30.17,17.46 29.85,17.46 26.42,20.89 26.42,21.13 21.59,25.96 21.59,28.23 C60.1 18.95,30.87 18.87,30.87 18.47,31.27 18.47,32.33 17.12,33.68 17.12,37.86 16.64,38.34 15.38,38.34 14.76,38.96 14.76,41.9 14.24,42.42 12.48,42.42 R51.2 10.86,44.88 11.34,45.36 11.34,49.55 D5.A 9.84,50.27 9.3,49.73 8.27,49.73 7.03,50.98 S1.1 | B1.RESET@1 33.02,12.03 v32.53,12.52
  Bottom 0.305: v35.41,13.31 34.61,12.52 v32.53,12.52 32.53,14.96 36.63,19.05 37.61,19.05 37.76,19.2 57.49,19.2 B1.RESET@2
RX
  Top 0.254: U$1.3 11.03,34.51 11.24,34.51 12.24,33.5 12.24,30.55 12.49,30.3 12.49,29.75 12.24,29.5 12.24,29.33 12.49,29.08 12.49,28.79 13.7,27.58 13.87,27.58 | 13.87,27.58 16.07,27.58 R60.1 | 13.87,27.58 13.87,27.11 D3.C
RXD  (via drill 0.35)
  Top 0.305: U1.30 39.73,15.65 38.68,14.6 38.68,14.14 37.48,12.93 36.68,12.93 36.6,12.85 35.92,12.85 35.69,12.63 35.12,12.63 34.9,12.85 33.81,12.85 v29.88,16.78 25.96,20.7 25.96,20.94 21.13,25.77 21.13,26.45 R61.2
  Bottom 0.305: v29.88,16.78 29.88,17.34 46.91,34.36 47.06,34.36 47.73,35.03 47.73,35.18 48.13,35.58 48.45,35.58 49.9,37.03 50.03,37.03 52.76,39.76 53.07,39.76 53.74,40.43 53.74,41.04 55.86,43.16 55.86,43.31 56.26,43.71 56.41,43.71 B1.D0
SCK  (via drill 0.35)
  Top 0.305: v34.59,28.4 34.24,28.04 U1.17 34.45,23.11 36.88,23.11 37.16,22.84 37.72,22.84 38,23.11 v39.06,23.11 | R81.1 28.96,50.13 B1.D13
  Bottom 0.305: B1.D13 34.29,45.47 37.61,45.47 39.61,43.46 39.61,36.79 38.43,35.61 36.54,35.61 35.51,34.58 35.51,29.31 v34.59,28.4 | B1.SCK 43.84,27.89 v39.06,23.11
SCL  (via drill 0.35)
  Top 0.305: B1.SCL 18.8,48.91 18.29,48.4 18.29,45.02 17.5,44.23 17.5,43.2 18.23,42.47 19.26,42.47 20.5,43.71 J1.3 26.04,38.96 32.97,38.96 36.78,35.15 36.78,34.34 | JP1.4 36.78,34.34 | 36.78,34.34 35.81,33.38 35.81,31.65 26.87,22.71 26.87,21.08 30.04,17.92 30.36,17.92 31.02,17.25 31.02,16.93 34.19,13.77 34.9,13.77 35.12,13.99 35.69,13.99 35.92,13.77 36.22,13.77 36.3,13.85 37.1,13.85 37.77,14.51 37.77,15.31 38.13,15.68 U1.28 38.04,16.32 38.04,17.47 38.12,17.55 38.12,18.11 38.04,18.19 v38.04,18.51
  Bottom 0.305: B1.A5 47.53,18.51 v38.04,18.51
SDA  (via drill 0.35)
  Top 0.305: B1.SDA 18.75,48.21 18.75,47.72 arc90 19.09,47.37 20.62,47.37 arc-90 20.96,47.03 20.96,46.97 arc-90 20.62,46.62 19.09,46.62 arc90 18.75,46.28 J1.4 19.53,43.71 20.77,44.96 21.8,44.96 22.58,44.18 22.58,43.2 23.31,42.47 23.37,42.47 26.42,39.42 33.16,39.42 33.21,39.37 33.38,39.37 37.14,35.61 37.42,35.61 38.05,34.99 38.05,33.07 JP1.2 27.33,22.35 27.33,21.27 30.23,18.38 30.55,18.38 31.48,17.44 31.48,17.12 34.38,14.22 34.71,14.22 34.94,14.45 36.2,14.45 36.34,14.3 36.91,14.3 37.31,14.7 37.31,15.5 37.33,15.52 | v37.44,17.83 37.44,16.31 37.44,15.63 37.33,15.52 | 37.33,15.52 U1.27
  Bottom 0.305: B1.A4 45.67,17.83 v37.44,17.83
TX
  Top 0.254: U$1.2 11.51,36.45 12.65,35.31 12.65,30.72 12.9,30.46 12.9,28.96 13.87,27.99 R61.1 17.89,27.2 18.72,26.37 18.72,25.14 18.32,24.74 D4.C
TXD  (via drill 0.35)
  Top 0.305: R60.2 19.8,25.55 20.7,25.55 24.19,22.06 25.5,20.75 25.5,20.51 29.2,16.81 29.2,16.5 | U1.31 40.32,16.02 40.32,15.47 39.7,14.86 39.59,14.86 39.14,14.4 39.14,13.95 37.67,12.47 36.87,12.47 36.79,12.39 36.11,12.39 35.88,12.17 34.94,12.17 34.71,12.39 33.62,12.39 29.92,16.09 29.6,16.09 29.2,16.5 | v28.97,16.61 29.08,16.61 29.2,16.5
  Bottom 0.305: B1.D1 60.96,49.07 53.28,41.4 53.28,40.62 52.89,40.22 52.56,40.22 49.84,37.49 49.71,37.49 49.1,36.88 48.77,36.88 28.97,17.09 v28.97,16.61
(copper drawn outside any net)
  shapes: Top area x2946

### Text on the board
Bottom: rev1 ver1 | Designed & Built in Turkey | 03/09/2018
tNames: D9 | D8 | D7 | D6 | D5 | D4 | D3 | D2 | D1 | D0 | SCL | SDA | GND | D13 | D12 | D11 | D10 | AREF | RESET | D13 | SDA | SCL | 5V | GND | PWR | SCL | SDA | TX | OFF | RX | ON | IOREF | !RESET | 3.3V | 5V | GND | GND | VIN | A0 | A1 | A2 | A3 | A4 | A5 | RPROG
bNames: L12 | L11 | L10 | L9 | L8